# Altium project Ver3.PrjPcb
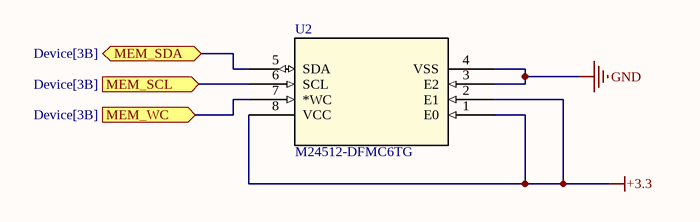
[diagram p0: M24512-DFMC6TG.SchDoc]
9 sheets, 67 parts. Net scope: hierarchical (ports join the sheet entries above them; power ports are global).
Board file: Power.PcbDoc
Sheets:
  M24512-DFMC6TG.SchDoc
  LPS22HBTR.SchDoc
  LSM6DSRXTR.SchDoc
  ST25DV64K-JFR6D3.SchDoc
  SWD.SchDoc
  STM32WB55CGU6.SchDoc
  Power.SchDoc
    U_L6924D013TR = L6924D013TR.SchDoc
    U_LD3985M33R = LD3985M33R.SchDoc

## Sheet M24512-DFMC6TG.SchDoc
size A4; SheetNumber: 3; SheetTotal: 11

### Parts
U2  M24512-DFMC6TG  [UFDFPN8_STM]

### Ports
MEM_SCL (in, see Device[3B]), MEM_SDA (bidir, see Device[3B]), MEM_WC (in, see Device[3B])

### Nets
+3.3: U2.1(E0) U2.2(E1) U2.8(VCC)
GND: U2.3(E2) U2.4(VSS)
NetU2_5: U2.5(SDA) ; port MEM_SDA
NetU2_6: U2.6(SCL) ; port MEM_SCL
NetU2_7: U2.7(*WC) ; port MEM_WC

### Library data of the parts
U2 = M24512-DFMC6TG: Mfr_Name: STMicroelectronics; Copyright: Copyright (C) 2023 Ultra Librarian. All rights reserved.; Manufacturer_Part_Number: M24512-DFMC6TG; RefDes: RefDes; Type: DEV

## Sheet LPS22HBTR.SchDoc
size A4; SheetNumber: 5; SheetTotal: 11
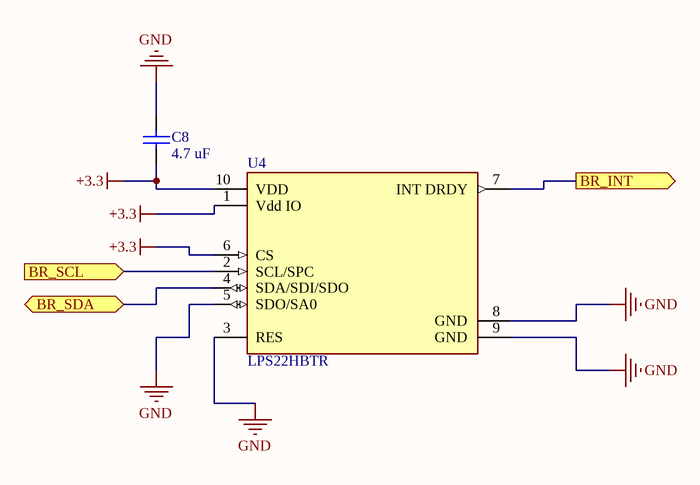
[diagram p1: LPS22HBTR.SchDoc]

### Parts
C8  4.7 uF  [CAPC1005X55X25NL05T10]
U4  LPS22HBTR  [FP-HLGA-10L-8479831-0]

### Ports
BR_INT (out), BR_SCL (in), BR_SDA (bidir)

### Nets
+3.3: C8.2 U4.1(Vdd_IO) U4.6(CS) U4.10(VDD)
GND: C8.1 U4.3(RES) U4.5(SDO/SA0) U4.8(GND) U4.9(GND)
NetU4_2: U4.2(SCL/SPC) ; port BR_SCL
NetU4_4: U4.4(SDA/SDI/SDO) ; port BR_SDA
NetU4_7: U4.7(INT_DRDY) ; port BR_INT

### Library data of the parts
C8 = CMP-2008-04515-1: Manufacturer: Murata; Part Number: GRM155F50J684ZE01D
U4 = CMP-12182-000004-1: MEMS NANO PRESSURE SENSOR: 260-1; Manufacturer: STMicroelectronics; Sensor Output: I2C,SPI; Port Style: No Port; Max Supply Voltage: 3.6V; Operating Supply Current: 3-12uA; Min Supply Voltage: 1.7V; Device Class L3: unset; Device Class L1: Sensors; Manufacturer Part Number: LPS22HBTR; Temperature Range High: +85°C; Digikey Description: MEMS NANO PRESSURE SENSOR: 260-1; Device Class L2: Pressure Sensors; RoHS: TRUE; Lead Free: Yes; Height: 0.8mm; Automotive: No; Octopart: https://octopart.com/lps22hbtr-stmicroelectronics-51851131; Package: HLGA-10L-8479831; Temperature Range Low: -40°C; Category: IC; Temperature: -40°C to +85°C; ComponentLink2Description: Datasheet; ComponentLink2URL: https://www.st.com/resource/en/datasheet/lps22hb.pdf; Footprint Url: https://www.st.com/content/ccc/resource/technical/document/technical_note/73/17/9c/16/dd/96/4a/01/CD00134799.pdf/files/CD00134799.pdf/jcr:content/translations/en.CD00134799.pdf

## Sheet LSM6DSRXTR.SchDoc
size A4; SheetNumber: 6; SheetTotal: 11
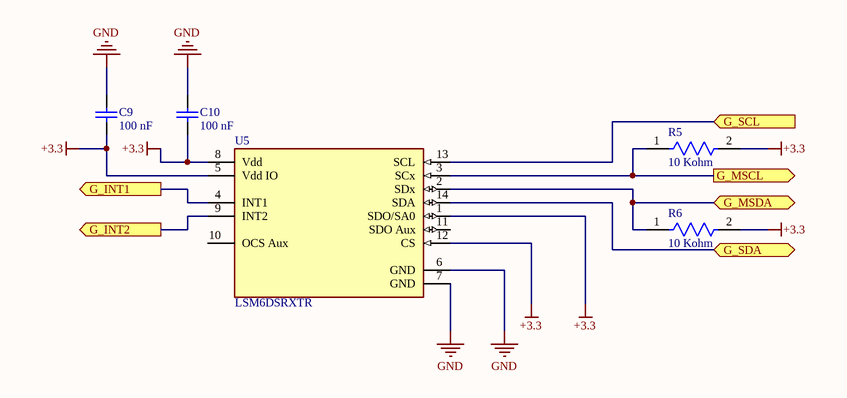
[diagram p2: LSM6DSRXTR.SchDoc]

### Parts
C9  100 nF  [CAPC1005X55X25NL05T10]
C10  100 nF  [CAPC1005X55X25NL05T10]
R5  10 Kohm  [FP-RC1005-IPC_C]
R6  10 Kohm  [FP-RC1005-IPC_C]
U5  LSM6DSRXTR  [FP-LGA-14L-DM00249496-MFG]

### Ports
G_INT1 (out), G_INT2 (out), G_MSCL (out), G_MSDA (bidir), G_SCL (in), G_SDA (bidir)

### Nets
+3.3: C9.2 C10.2 R5.2 R6.2 U5.1(SDO/SA0) U5.5(Vdd_IO) U5.8(Vdd) U5.12(CS)
GND: C9.1 C10.1 U5.6(GND) U5.7(GND)
NetR5_1: R5.1 U5.3(SCx) ; port G_MSCL
NetR6_1: R6.1 U5.2(SDx) ; port G_MSDA
NetU5_4: U5.4(INT1) ; port G_INT1
NetU5_9: U5.9(INT2) ; port G_INT2
NetU5_13: U5.13(SCL) ; port G_SCL
NetU5_14: U5.14(SDA) ; port G_SDA

Not connected (* = marked no-connect by the designer): U5 10(OCS_Aux) 11(SDO_Aux)

### Library data of the parts
C9 C10 = CMP-2008-04515-1: as C8 on sheet LPS22HBTR
R5 R6 = CMP-13261-000953-1: Res Thick Film 0402 1.87kΩ 1% 0.063W ±100ppm/°C Molded SMD T/R; Power Rating: 63mW; Voltage Rating (DC): 50V; Resistance: 1.87kR; Tolerance: 1%; Height: 0.016inch; Length: 1mm; Case Code (Metric): 1005; Width: 0.02inch; Max Power Dissipation: 63mW; Radiation Hardening: No; Features: Moisture Resistant; Temperature Coefficient: 100ppm/°C; Min Operating Temperature: -55°C; Number of Terminations: 2; Max Operating Temperature: 155°C; Case Code (Imperial): 0402; Composition: Thick Film; Depth: 0.5mm; Lead Free: Lead Free; Package Quantity: 1; Case/Package: 0402; Packaging: Tape and Reel; Contact Plating: Tin; Military Standard: Not
U5 = CMP-12177-000016-1: CONSUMER MEMS; RoHS Compliant: Yes

## Sheet ST25DV64K-JFR6D3.SchDoc
size A4; SheetNumber: 7; SheetTotal: 11
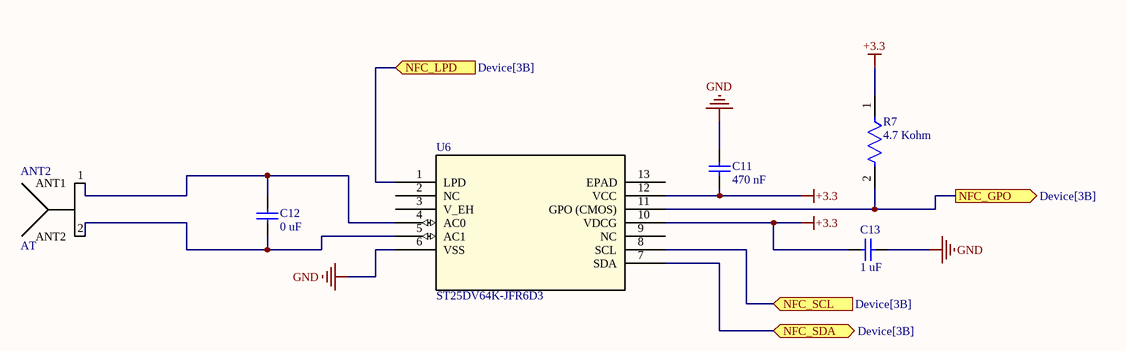
[diagram p3: ST25DV64K-JFR6D3.SchDoc]

### Parts
ANT2  AT  [AC]
C11  470 nF  [CAPC1005X55X25NL05T10]
C12  0 uF  [CAPC1005X55X25NL05T10]
C13  1 uF  [CAPC1005X55X25NL05T10]
R7  4.7 Kohm  [FP-RC1005-IPC_C]
U6  ST25DV64K-JFR6D3  [UFDFPN12_3X3_STM]

### Ports
NFC_GPO (out, see Device[3B]), NFC_LPD (in, see Device[3B]), NFC_SCL (in, see Device[3B]), NFC_SDA (bidir, see Device[3B])

### Nets
+3.3: C11.2 C13.1 R7.1 U6.10(VDCG) U6.12(VCC)
GND: C11.1 C13.2 U6.6(VSS)
NetANT2_1: ANT2.1(ANT1) C12.1 U6.4(AC0)
NetANT2_2: ANT2.2(ANT2) C12.2 U6.5(AC1)
NetR7_2: R7.2 U6.11(GPO_(CMOS)) ; port NFC_GPO
NetU6_1: U6.1(LPD) ; port NFC_LPD
NetU6_7: U6.7(SDA) ; port NFC_SDA
NetU6_8: U6.8(SCL) ; port NFC_SCL

Not connected (* = marked no-connect by the designer): U6 2(NC) 3(V_EH) 9(NC) 13(EPAD)

### Library data of the parts
C11-C13 = CMP-2008-04515-1: as C8 on sheet LPS22HBTR
R7 = CMP-13261-000953-1: as R5 on sheet LSM6DSRXTR; Tolerance: 1%; Height: 0.016inch; Length: 1mm; Case Code (Metric): 1005; Width: 0.02inch; Max Power Dissipation: 63mW; Radiation Hardening: No; Features: Moisture Resistant; Temperature Coefficient: 100ppm/°C; Min Operating Temperature: -55°C; Number of Terminations: 2; Max Operating Temperature: 155°C; Case Code (Imperial): 0402; Composition: Thick Film; Depth: 0.5mm; Lead Free: Lead Free; Package Quantity: 1; Case/Package: 0402; Packaging: Tape and Reel; Contact Plating: Tin; Military Standard: Not
U6 = ST25DV64K-JFR6D3: Mfr_Name: STMicroelectronics; Copyright: Copyright (C) 2023 Ultra Librarian. All rights reserved.; Manufacturer_Part_Number: ST25DV64K-JFR6D3; RefDes: RefDes; Type: DEV

## Sheet SWD.SchDoc
size A4; SheetNumber: 9; SheetTotal: 11
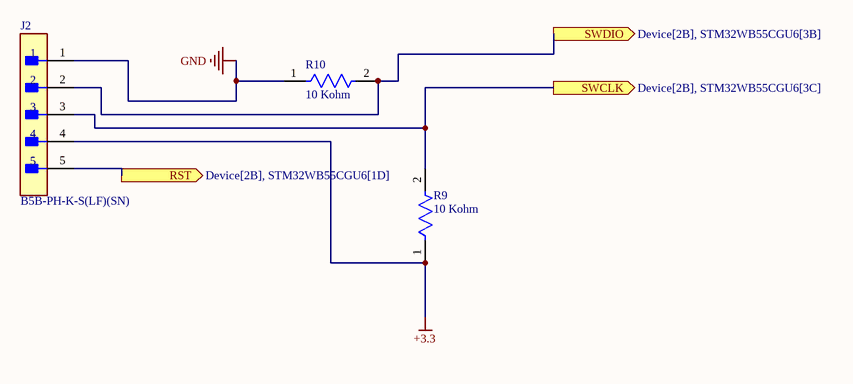
[diagram p4: SWD.SchDoc]

### Parts
J2  B5B-PH-K-S(LF)(SN)  [FP-B5B-PH-K-S_LF_SN-MFG]
R9  10 Kohm  [FP-RC1005-IPC_C]
R10  10 Kohm  [FP-RC1005-IPC_C]

### Ports
RST (out, see Device[2B], STM32WB55CGU6[1D]), SWCLK (out, see Device[2B], STM32WB55CGU6[3C]), SWDIO (out, see Device[2B], STM32WB55CGU6[3B])

### Nets
+3.3: J2.4 R9.1
GND: J2.1 R10.1
NetJ2_2: J2.2 R10.2 ; port SWDIO
NetJ2_3: J2.3 R9.2 ; port SWCLK
NetJ2_5: J2.5 ; port RST

### Library data of the parts
J2 = CMP-2000-05908-2: CONN HEADER VERT 5POS 2MM; Voltage Rating (AC): 100V; Number of Positions: 5; Contact Resistance: 20mR; Insulation Resistance: 1MR; Current Rating: 2A; Gender: Male; Mated Stacking Heights: 8mm; Series: PH; Number of Poles: 5; Width: 4.5mm; Insulation Color: Natural; Fastening Type: Detent; Flammability Rating: UL94 V-0; Mount: Through Hole; Lead Free: Lead Free; Number of Rows: 1; REACH SVHC: No SVHC; Max Voltage Rating (AC): 100V; Contact Mating Length: 0.13inch; Contact Plating: Tin; Housing Material: Polyamide; Depth: 4.5mm; Contact Type: Male Pin; Voltage Rating: 100V; Color: Natural; Housing Color: White; Lead Pitch: 2mm; Number of Contacts: 5; Orientation: Straight; Packaging: Bulk; Contact Material: Brass; Pitch: 2mm; Insulation Material: Nylon; Connector Type: Header; Contact Finish - Mating: TIN; Termination: Solder; Number of Pins: 5; Length: 11.9mm; Contact Shape: Square; Max Current Rating: 2A; Working Voltage: 100V; Min Operating Temperature: -25°C; Max Operating Temperature: 85°C; Material: Polyamide; Height: 9.4mm
R9 R10 = CMP-13261-000953-1: as R5 on sheet LSM6DSRXTR; Tolerance: 1%; Height: 0.016inch; Length: 1mm; Case Code (Metric): 1005; Width: 0.02inch; Max Power Dissipation: 63mW; Radiation Hardening: No; Features: Moisture Resistant; Temperature Coefficient: 100ppm/°C; Min Operating Temperature: -55°C; Number of Terminations: 2; Max Operating Temperature: 155°C; Case Code (Imperial): 0402; Composition: Thick Film; Depth: 0.5mm; Lead Free: Lead Free; Package Quantity: 1; Case/Package: 0402; Packaging: Tape and Reel; Contact Plating: Tin; Military Standard: Not

## Sheet STM32WB55CGU6.SchDoc
size A4; SheetNumber: 11; SheetTotal: 11
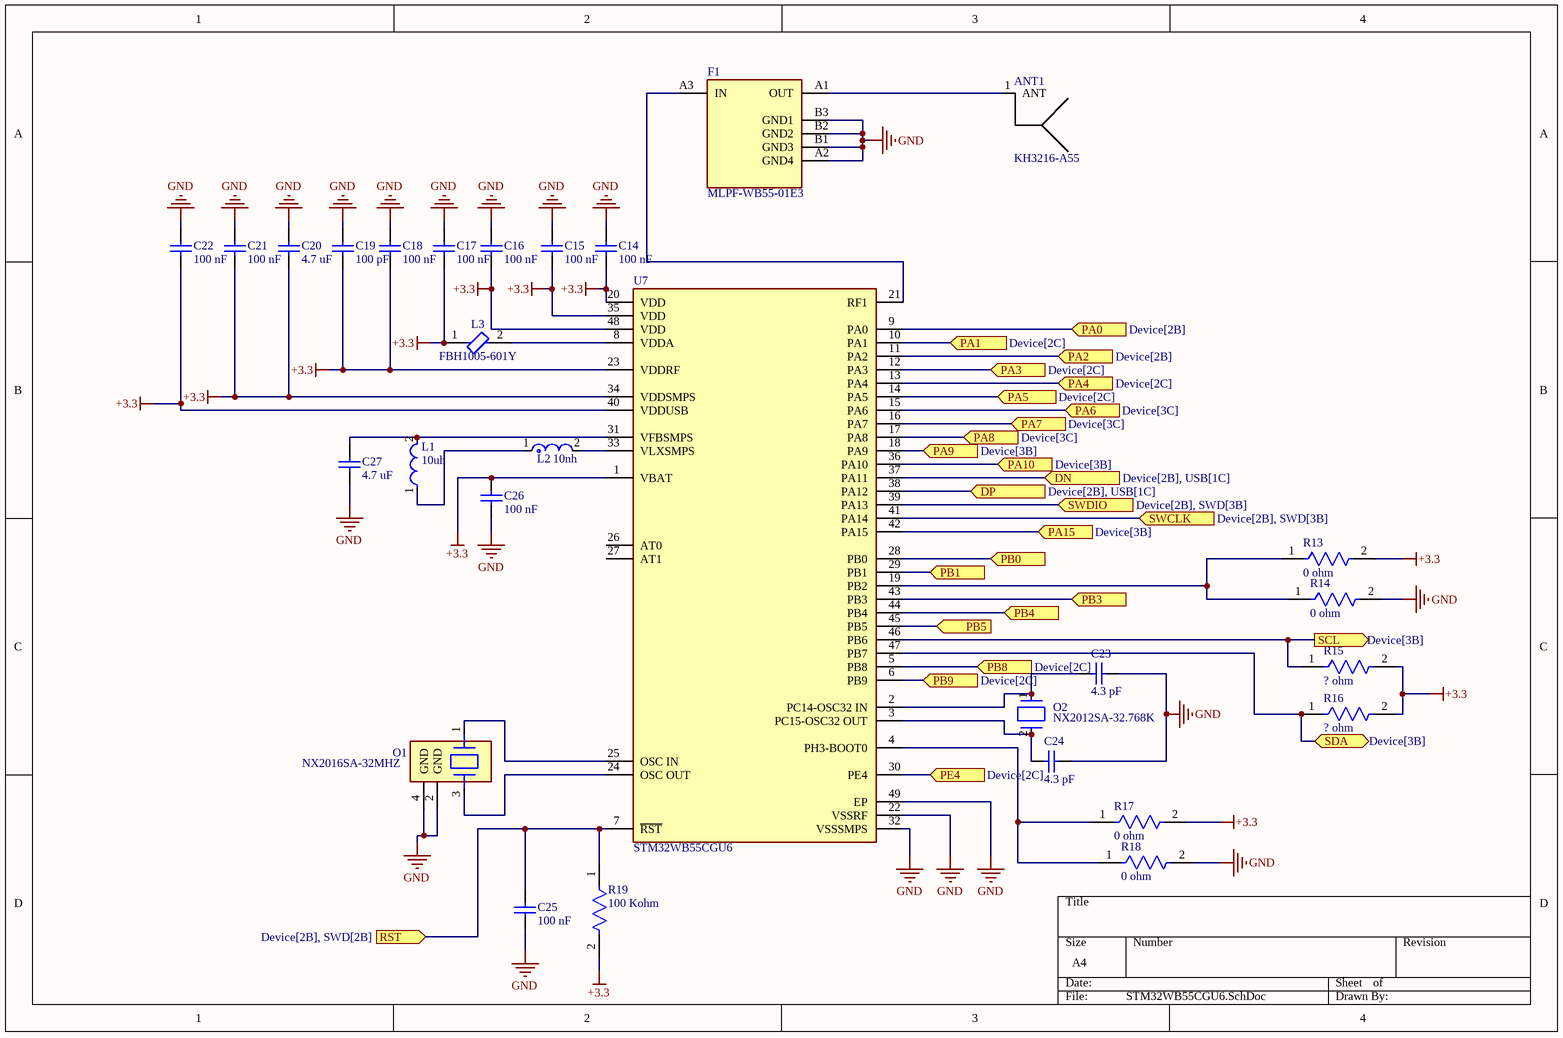
[diagram p5: STM32WB55CGU6.SchDoc]

### Parts
ANT1  KH3216-A55  [KH3216-A55]
C14  100 nF  [CAPC1005X55X25NL05T10]
C15  100 nF  [CAPC1005X55X25NL05T10]
C16  100 nF  [CAPC1005X55X25NL05T10]
C17  100 nF  [CAPC1005X55X25NL05T10]
C18  100 nF  [CAPC1005X55X25NL05T10]
C19  100 pF  [CAPC1005X55X25NL05T10]
C20  4.7 uF  [CAPC1005X55X25NL05T10]
C21  100 nF  [CAPC1005X55X25NL05T10]
C22  100 nF  [CAPC1005X55X25NL05T10]
C23  4.3 pF  [CAPC1005X55X25NL05T10]
C24  4.3 pF  [CAPC1005X55X25NL05T10]
C25  100 nF  [CAPC1005X55X25NL05T10]
C26  100 nF  [CAPC1005X55X25NL05T10]
C27  4.7 uF  [CAPC1005X55X25NL05T10]
F1  MLPF-WB55-01E3  [FP-MLPF-WB55-01E3-MFG]
L1  10uh  [FP-LQM21FN_70-MFG]
L2  10nh  [FP-LQG15WH_02-MFG]
L3  FBH1005-601Y  [FP-BLM15-0_05-MFG]
O1  NX2016SA-32MHZ  [FP-NX2016SA-MFG]
O2  NX2012SA-32.768K  [FP-NX2012SA-MFG]
R13  0 ohm  [FP-RC1005-IPC_C]
R14  0 ohm  [FP-RC1005-IPC_C]
R15  ? ohm  [FP-RC1005-IPC_C]
R16  ? ohm  [FP-RC1005-IPC_C]
R17  0 ohm  [FP-RC1005-IPC_C]
R18  0 ohm  [FP-RC1005-IPC_C]
R19  100 Kohm  [FP-RC1005-IPC_C]
U7  STM32WB55CGU6  [FP-STM32WB55CGU6-MFG]

### Ports
DN (in, see Device[2B], USB[1C]), DP (in, see Device[2B], USB[1C]), PA0 (in, see Device[2B]), PA1 (in, see Device[2C]), PA2 (in, see Device[2B]), PA3 (in, see Device[2C]), PA4 (in, see Device[2C]), PA5 (in, see Device[2C]), PA6 (in, see Device[3C]), PA7 (in, see Device[3C]), PA8 (in, see Device[3C]), PA9 (in, see Device[3B]), PA10 (in, see Device[3B]), PA15 (in, see Device[3B]), PB0 (in), PB1 (in), PB3 (in), PB4 (in), PB5 (in), PB8 (in, see Device[2C]), PB9 (in, see Device[2C]), PE4 (in, see Device[2C]), RST (in, see Device[2B], SWD[2B]), SCL (out, see Device[3B]), SDA (bidir, see Device[3B]), SWCLK (in, see Device[2B], SWD[3B]), SWDIO (in, see Device[2B], SWD[3B])

### Nets
+3.3: C14.1 C15.2 C16.1 C17.2 C18.1 C19.2 C20.2 C21.1 C22.2 C26.2 L3.1 R13.2 R15.2 R16.2 R17.2 R19.2 U7.1(VBAT) U7.20(VDD) U7.23(VDDRF) U7.34(VDDSMPS) U7.35(VDD) U7.40(VDDUSB) U7.48(VDD)
GND: C14.2 C15.1 C16.2 C17.1 C18.2 C19.1 C20.1 C21.2 C22.1 C23.2 C24.1 C25.1 C26.1 C27.2 F1.A2(GND4) F1.B1(GND3) F1.B2(GND2) F1.B3(GND1) O1.2(GND) O1.4(GND) R14.2 R18.2 U7.22(VSSRF) U7.32(VSSSMPS) U7.49(EP)
NetANT1_1: ANT1.1(ANT) F1.A1(OUT)
NetC23_1: C23.1 O2.1 U7.2(PC14-OSC32_IN)
NetC24_2: C24.2 O2.2 U7.3(PC15-OSC32_OUT)
NetC25_2: C25.2 R19.1 U7.7(~{RST}) ; port RST
NetC27_1: C27.1 L1.2 U7.31(VFBSMPS)
NetF1_A3: F1.A3(IN) U7.21(RF1)
NetL1_1: L1.1 L2.1
NetL2_2: L2.2 U7.33(VLXSMPS)
NetL3_2: L3.2 U7.8(VDDA)
NetO1_1: O1.1 U7.25(OSC_IN)
NetO1_3: O1.3 U7.24(OSC_OUT)
NetR13_1: R13.1 R14.1 U7.19(PB2)
NetR15_1: R15.1 U7.46(PB6) ; port SCL
NetR16_1: R16.1 U7.47(PB7) ; port SDA
NetR17_1: R17.1 R18.1 U7.4(PH3-BOOT0)
NetU7_5: U7.5(PB8) ; port PB8
NetU7_6: U7.6(PB9) ; port PB9
NetU7_9: U7.9(PA0) ; port PA0
NetU7_10: U7.10(PA1) ; port PA1
NetU7_11: U7.11(PA2) ; port PA2
NetU7_12: U7.12(PA3) ; port PA3
NetU7_13: U7.13(PA4) ; port PA4
NetU7_14: U7.14(PA5) ; port PA5
NetU7_15: U7.15(PA6) ; port PA6
NetU7_16: U7.16(PA7) ; port PA7
NetU7_17: U7.17(PA8) ; port PA8
NetU7_18: U7.18(PA9) ; port PA9
NetU7_28: U7.28(PB0) ; port PB0
NetU7_29: U7.29(PB1) ; port PB1
NetU7_30: U7.30(PE4) ; port PE4
NetU7_36: U7.36(PA10) ; port PA10
NetU7_37: U7.37(PA11) ; port DN
NetU7_38: U7.38(PA12) ; port DP
NetU7_39: U7.39(PA13) ; port SWDIO
NetU7_41: U7.41(PA14) ; port SWCLK
NetU7_42: U7.42(PA15) ; port PA15
NetU7_43: U7.43(PB3) ; port PB3
NetU7_44: U7.44(PB4) ; port PB4
NetU7_45: U7.45(PB5) ; port PB5

Not connected (* = marked no-connect by the designer): U7 26(AT0) 27(AT1)

### Library data of the parts
C14-C27 = CMP-2008-04515-1: as C8 on sheet LPS22HBTR
F1 = CMP-12074-000002-1: RF FILTER LOW PASS 2.45GHZ 6SMD
L1 = CMP-2000-06587-2: FIXED IND 10UH 100MA 780MOHM SMD; Shielding: Shielded; Core Material: Ferrite; Self Resonant Frequency: 15MHz; Tolerance: 20%; DC Resistance (DCR): 780mR; Test Frequency: 1MHz; Height: 1.45mm; Package Quantity: 3000; Width: 0.049inch; Inductance: 10uH; Saturation Current: 100mA; Termination: SMD/SMT; Case Code (Metric): 2012; Case/Package: 0805; RoHS Compliant: Yes; Series: LQM21F_70; Max Operating Temperature: 125°C; Lead Free: Lead Free; DC Current: 100mA; Length: 2.2mm; Radiation Hardening: No; Max DC Current: 100mA; Case Code (Imperial): 0805; Packaging: Tape and Reel; Height - Seated (Max): 0.057inch; Rated Current-Max: 100mA; Military Standard: Not; Mount: Surface Mount; Min Operating Temperature: -55°C; Depth: 1.45mm; Current Rating: 100mA
L2 = CMP-06042-005237-1: Multilayer type Inductor for Automotive 10nH ±5% 0.19Ω 500mA 0402; Core Material: Air; Test Frequency: 100MHz; DC Resistance (DCR): 190mR; Shielding: Unshielded; Self Resonant Frequency: 3.3GHz; Min Operating Temperature: -55°C; Tolerance: 5%; Inductance: 10nH; Max Operating Temperature: 125°C; Packaging: Cut Tape; Current Rating: 500mA; Case Code (Metric): 1005; Mount: Surface Mount; Case/Package: 0402; Ratings: AEC-Q200; Case Code (Imperial): 0402
L3 = CMP-0686-00187-4: Chip Ferrite Bead, 0402, 600Ω @ 100MHz, 0.52Ω, 25%, 300mA; DC Resistance-Max: 600mR; Number of Lines: 1; DC Resistance (DCR): 520mR; Shielding: Unshielded; Impedance: 600R; Material: Steel; Frequency: 100MHz; Lead Free: Lead Free; Max DC Current: 300mA; Test Frequency: 100MHz; Depth: 0.55mm; Length: 1mm; Case Code (Imperial): 0402; Packaging: Tape and Reel; Height: 0.5mm; Max Operating Temperature: 125°C; Military Standard: Not; REACH SVHC: No SVHC; Case Code (Metric): 1005; Series: BLM15AG_SN; Core Material: Ferrite; Termination: SMD/SMT; DC Current: 300mA; Package Quantity: 10000; Width: 0.5mm; RoHS Compliant: Yes; Min Operating Temperature: -55°C; Current Rating: 300mA; Case/Package: 0402; Number of Pins: 2; Radiation Hardening: No; Tolerance: 25%; Number of Circuits: 1; Max Current Rating: 300mA
O1 = CMP-200220-000017-1: CRYSTAL 32.0000MHZ 8PF SMD; Frequency: 32MHz; ESR (Equivalent Series Resistance): 60R; Ratings: AEC-Q200; Mount: Surface Mount; Case/Package: SMD/SMT; Packaging: Tape and Reel; Load Capacitance: 8pF; Min Operating Temperature: -40°C; Max Operating Temperature: 125°C
O2 = CMP-200220-000019-1: CRYSTAL 32.7680KHZ 12.5PF SMD; Frequency Tolerance: 20ppm; ESR (Equivalent Series Resistance): 80kR; Frequency: 32.768kHz; Mount: Surface Mount; Packaging: Cut Tape; Min Operating Temperature: -40°C; Max Operating Temperature: 85°C; Case/Package: SMD/SMT; RoHS Compliant: Yes; Length: 0.081inch; Series: NX2012SA; Height: 0.024inch; Width: 0.047inch; Load Capacitance: 12.5pF
R13-R19 = CMP-13261-000953-1: as R5 on sheet LSM6DSRXTR; Tolerance: 1%; Height: 0.016inch; Length: 1mm; Case Code (Metric): 1005; Width: 0.02inch; Max Power Dissipation: 63mW; Radiation Hardening: No; Features: Moisture Resistant; Temperature Coefficient: 100ppm/°C; Min Operating Temperature: -55°C; Number of Terminations: 2; Max Operating Temperature: 155°C; Case Code (Imperial): 0402; Composition: Thick Film; Depth: 0.5mm; Lead Free: Lead Free; Package Quantity: 1; Case/Package: 0402; Packaging: Tape and Reel; Contact Plating: Tin; Military Standard: Not
U7 = CMP-12105-000013-1: ULTRA-LOW-POWER DUAL CORE ARM CO; Manufacturer: STMicroelectronics; Number Of Cores: 1; Number Of I2C Channels: 2; Interface: I2C,SPI,UART,USART,2-Wire,USB,IrDA,Other; Core Architecture: ARM Cortex-M4; Data Bus Width: 32bits; Memory Size: 1MBytes; Number Of Pwm Channels: 14; Max Supply Voltage: 3.6V; Standoff Height: 0mm; Number Of Timers/Counters: 6; Frequency: 64MHz; Max Junction Temp: +105°C; Number Of I/Os: 30; Min Supply Voltage: 1.71V; Number Of Adc Channels: 13; Ram Size: 256KBytes; Memory Type: FLASH; Octopart: https://octopart.com/stm32wb55cgu6-stmicroelectronics-98750847; Temperature Range High: +105°C; RoHS: TRUE; Number Of Spi Channels: 1; Category: IC; Device Class L1: Integrated Circuits (ICs); Lead Free: Yes; Height: 0.65mm; Number Of A/D Converters: 1; Package: UFQFPN48; Number Of Usb Channels: 1; Number Of Uart Channels: 2; Temperature Range Low: -40°C; Ambient Temperature Range Low: -40°C; Device Class L3: Microcontrollers; Manufacturer Part Number: STM32WB55CGU6; Temperature: -40°C to +105°C; ComponentLink2URL: https://www.st.com/resource/en/datasheet/stm32wb55cg.pdf; Device Class L2: Embedded Processors and Controllers; Digikey Description: ULTRA-LOW-POWER DUAL CORE ARM CO; ComponentLink2Description: Datasheet; Ambient Temperature Range High: +85°C; Automotive: No

## Sheet Power.SchDoc
size A4; SheetNumber: 8; SheetTotal: 11
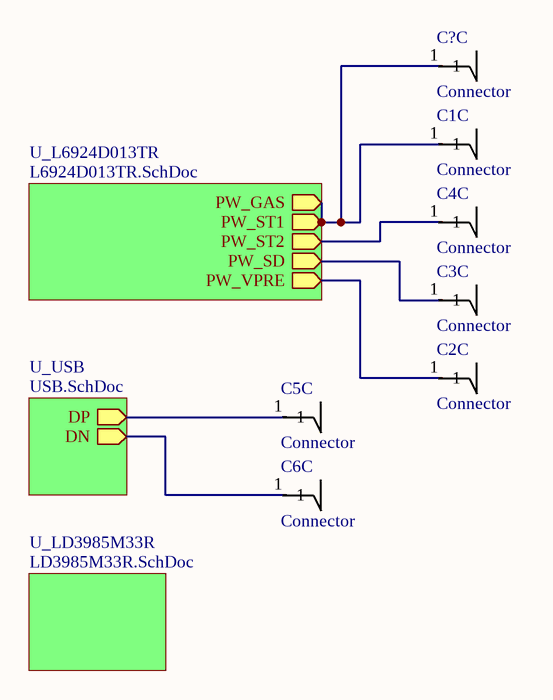
[diagram p6: Power.SchDoc]

### Parts
(Parts that share a designator on the sheet are numbered #1, #2 ... from top to bottom, then left to right.)
C1#1  Connector  (part C of 3)
C2#1  Connector  (part C of 3)
C3#1  Connector  (part C of 3)
C4#1  Connector  (part C of 3)
C5#1  Connector  (part C of 3)
C6#1  Connector  (part C of 3)
C?  Connector  (part C of 3)

### Sub-sheets
U_L6924D013TR = L6924D013TR.SchDoc: PW_GAS (out), PW_ST1 (out), PW_ST2 (out), PW_SD (out), PW_VPRE (out)
U_LD3985M33R = LD3985M33R.SchDoc: no entries
U_USB = USB.SchDoc (file not in this document): DP (out), DN (out)

### Nets
NetC1#1_1: C1#1.1 C?.1 ; sheet U_L6924D013TR/PW_GAS, sheet U_L6924D013TR/PW_ST1
NetC2#1_1: C2#1.1 ; sheet U_L6924D013TR/PW_VPRE
NetC3#1_1: C3#1.1 ; sheet U_L6924D013TR/PW_SD
NetC4#1_1: C4#1.1 ; sheet U_L6924D013TR/PW_ST2
NetC5#1_1: C5#1.1 ; sheet U_USB/DP
NetC6#1_1: C6#1.1 ; sheet U_USB/DN

## Sheet L6924D013TR.SchDoc
size A4; SheetNumber: 4; SheetTotal: 11
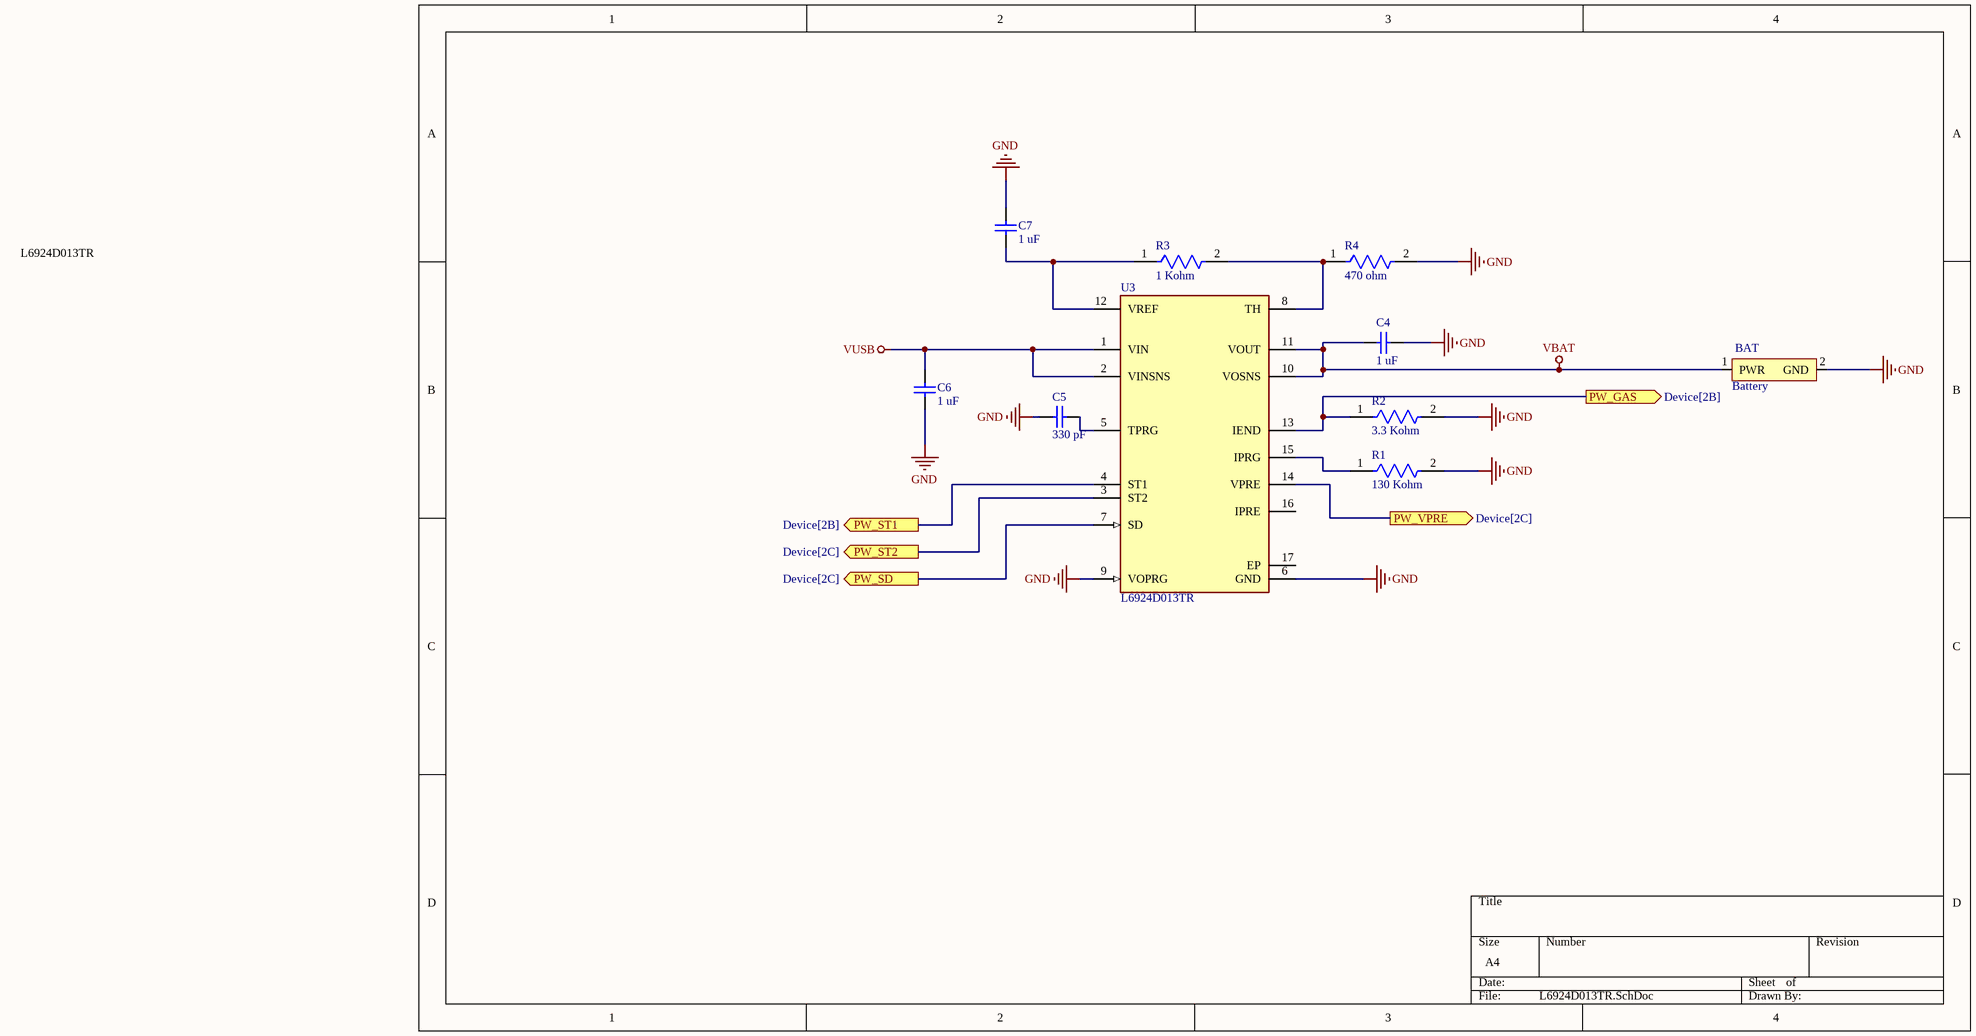
[diagram p7: L6924D013TR.SchDoc]

### Parts
(Parts that share a designator on the sheet are numbered #1, #2 ... from top to bottom, then left to right.)
BAT  Battery  [Battery]
C4#2  1 uF  [CAPC1005X55X25NL05T10]
C5#2  330 pF  [CAPC1005X55X25NL05T10]
C6#2  1 uF  [CAPC1005X55X25NL05T10]
C7  1 uF  [CAPC1005X55X25NL05T10]
R1  130 Kohm  [FP-RC1005-IPC_C]
R2  3.3 Kohm  [FP-RC1005-IPC_C]
R3  1 Kohm  [FP-RC1005-IPC_C]
R4  470 ohm  [FP-RC1005-IPC_C]
U3  L6924D013TR  [FP-VFQFPN16-7185330-MFG]

### Ports
PW_GAS (out, see Device[2B]), PW_SD (out, see Device[2C]), PW_ST1 (out, see Device[2B]), PW_ST2 (out, see Device[2C]), PW_VPRE (out, see Device[2C])

### Nets
GND: BAT.2(GND) C4#2.1 C5#2.2 C6#2.2 C7.1 R1.2 R2.2 R4.2 U3.6(GND) U3.9(VOPRG)
VBAT: BAT.1(PWR) C4#2.2 U3.10(VOSNS) U3.11(VOUT)
VUSB: C6#2.1 U3.1(VIN) U3.2(VINSNS)
NetC1#1_1: R2.1 U3.4(ST1) U3.13(IEND) ; port PW_GAS, port PW_ST1
NetC2#1_1: U3.14(VPRE) ; port PW_VPRE
NetC3#1_1: U3.7(SD) ; port PW_SD
NetC4#1_1: U3.3(ST2) ; port PW_ST2
NetC5#2_1: C5#2.1 U3.5(TPRG)
NetC7_2: C7.2 R3.1 U3.12(VREF)
NetR1_1: R1.1 U3.15(IPRG)
NetR3_2: R3.2 R4.1 U3.8(TH)

Not connected (* = marked no-connect by the designer): U3 16(IPRE) 17(EP)

### Notes on the sheet
- L6924D013TR

### Library data of the parts
C4#2 C5#2 C6#2 C7 = CMP-2008-04515-1: as C8 on sheet LPS22HBTR
R1-R4 = CMP-13261-000953-1: as R5 on sheet LSM6DSRXTR; Tolerance: 1%; Height: 0.016inch; Length: 1mm; Case Code (Metric): 1005; Width: 0.02inch; Max Power Dissipation: 63mW; Radiation Hardening: No; Features: Moisture Resistant; Temperature Coefficient: 100ppm/°C; Min Operating Temperature: -55°C; Number of Terminations: 2; Max Operating Temperature: 155°C; Case Code (Imperial): 0402; Composition: Thick Film; Depth: 0.5mm; Lead Free: Lead Free; Package Quantity: 1; Case/Package: 0402; Packaging: Tape and Reel; Contact Plating: Tin; Military Standard: Not
U3 = CMP-12147-000005-1: IC BATT CHRGR ION/POLY 16-VFQFPN; Manufacturer: STMicroelectronics; Output Current: 975mA; Number Of Cells: 1; Standoff Height: 0.02mm; Max Junction Temp: +125°C; Max Supply Voltage: 12V; Nominal Supply Current: 1.8mA; Max Power Dissipation: 0.67W; Min Supply Voltage: 2.5V; Output Voltage: 4.2V; Automotive: No; Manufacturer Part Number: L6924D013TR; Digikey Description: IC BATT CHRGR ION/POLY 16-VFQFPN; ComponentLink2Description: Datasheet; Footprint Url: https://www.st.com/resource/en/datasheet/l6738.pdf; Device Class L2: Power Management ICs; Package: VFQFPN16-7185330; Temperature Range High: +125°C; Mouser Description: Battery Management Battery Charger Sys Li-Ion/Li-Poly; Number Of Outputs: 1; Lead Free: Yes; Device Class L3: Battery Management; Category: IC; Temperature: -40°C to +125°C; Temperature Range Low: -40°C; Octopart: https://octopart.com/l6924d013tr-stmicroelectronics-421996; ComponentLink2URL: https://www.st.com/resource/en/datasheet/l6924d.pdf; Device Class L1: Integrated Circuits (ICs); Height: 1mm; Ipc Land Pattern Name: QFN50P300X300X90-16; RoHS: TRUE

## Sheet LD3985M33R.SchDoc
size A4; SheetNumber: 1; SheetTotal: 10
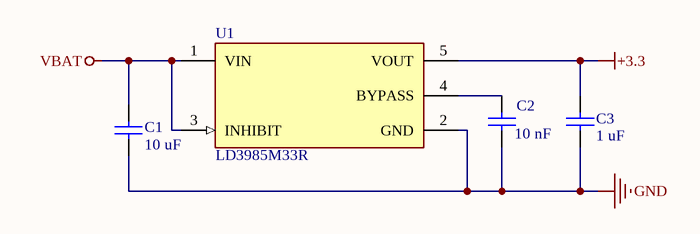
[diagram p8: LD3985M33R.SchDoc]

### Parts
(Parts that share a designator on the sheet are numbered #1, #2 ... from top to bottom, then left to right.)
C1#2  10 uF  [CAPC1005X55X25NL05T10]
C2#2  10 nF  [CAPC1005X55X25NL05T10]
C3#2  1 uF  [CAPC1005X55X25NL05T10]
U1  LD3985M33R  [FP-SOT23-5L-7049676-MFG]

### Nets
+3.3: C3#2.2 U1.5(VOUT)
GND: C1#2.1 C2#2.1 C3#2.1 U1.2(GND)
VBAT: C1#2.2 U1.1(VIN) U1.3(INHIBIT)
NetC2#2_2: C2#2.2 U1.4(BYPASS)

### Library data of the parts
C1#2 C2#2 C3#2 = CMP-2008-04515-1: as C8 on sheet LPS22HBTR
U1 = CMP-0244-00328-2: IC REG LINEAR 3.3V 150MA SOT23-5; Input Bias Current: 85uA; Output Type: Fixed; Max Input Voltage: 6V; Min Input Voltage: 2.5V; Output Voltage Accuracy: 2%; Quiescent Current: 150uA; Number of Regulators: 1; Min Current Limit: 300mA; Dropout Voltage: 60mV; Polarity: Positive; Min Operating Temperature: -40°C; Height: 1.3mm; Radiation Hardening: No; Package Quantity: 1; Number of Pins: 5; Output Current: 150mA; Width: 1.75mm; Length: 3mm; Mount: Surface Mount; Case/Package: SOT-23; Lead Free: Lead Free; Number of Outputs: 1; Max Operating Temperature: 125°C; Accuracy: 2%; Max Output Current: 150mA; Packaging: Tape and Reel; Output Voltage: 3.3V; Min Output Voltage: 3.3V

## Nets that join several sheets
+3.3: M24512-DFMC6TG (U2.1 U2.2 U2.8), LPS22HBTR (C8.2 U4.1 U4.6 U4.10), LSM6DSRXTR (8 pins), ST25DV64K-JFR6D3 (5 pins), SWD (J2.4 R9.1), STM32WB55CGU6 (23 pins), LD3985M33R (C3#2.2 U1.5)
GND: M24512-DFMC6TG (U2.3 U2.4), LPS22HBTR (5 pins), LSM6DSRXTR (C9.1 C10.1 U5.6 U5.7), ST25DV64K-JFR6D3 (C11.1 C13.2 U6.6), SWD (J2.1 R10.1), STM32WB55CGU6 (25 pins), L6924D013TR (10 pins), LD3985M33R (C1#2.1 C2#2.1 C3#2.1 U1.2)
VBAT: L6924D013TR (BAT.1 C4#2.2 U3.10 U3.11), LD3985M33R (C1#2.2 U1.1 U1.3)
NetC1#1_1: Power (C1#1.1 C?.1), L6924D013TR (R2.1 U3.4 U3.13)
NetC2#1_1: Power (C2#1.1), L6924D013TR (U3.14)
NetC3#1_1: Power (C3#1.1), L6924D013TR (U3.7)
NetC4#1_1: Power (C4#1.1), L6924D013TR (U3.3)